# EAGLE design CS-I-POT-10K (EAGLE 6.4)
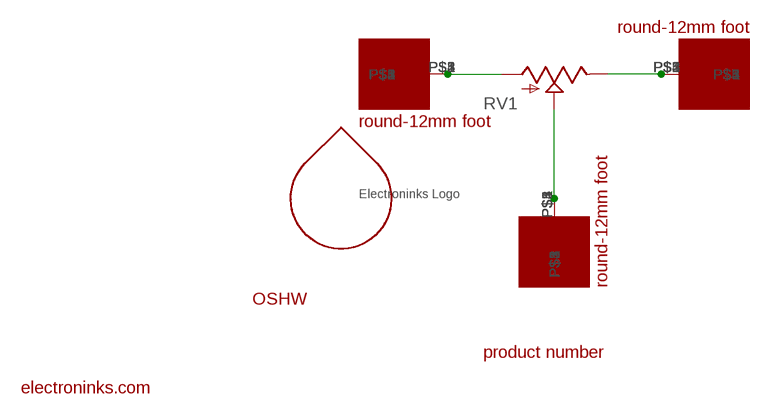
[diagram p0: schematic, sheet 1]

## Parts
RV1  POT  [ALPS_POT]
U$1  ROUND-12MM-FOOT-1.8MM  [ROUND-12MM-FOOT]
U$2  ROUND-12MM-FOOT-1.8MM  [ROUND-12MM-FOOT]
U$3  ROUND-12MM-FOOT-1.8MM  [ROUND-12MM-FOOT]
U$4  ELECTRONINKS_LOGO_15MM  [ELECTRONINKS_LOGO_15MM]
U$5  ELECTRONINKS_COM_15MM  [ELECTRONINKS_COM_15MM]
U$6  DROPLET_LOGO_4MM  [DROPLET_LOGO_4MM]
U$7  OSHW_4MM  [OHSW_4MM]
U$8  CS_I_POT_10K  [CS_I_POT_10K]

## Nets
N$1: RV1.P$3(A) U$1.P$1 U$1.P$2 U$1.P$3 U$1.P$4 U$1.P$5
N$2: RV1.P$1(E) U$3.P$1 U$3.P$2 U$3.P$3 U$3.P$4 U$3.P$5
N$3: RV1.P$2(S) U$2.P$1 U$2.P$2 U$2.P$3 U$2.P$4 U$2.P$5

## Library data of the parts
RV1 = SparkFun-Electromechanical:POT
U$1-U$3 = electroninks:ROUND-12MM-FOOT-1.8MM
U$4 = electroninks:ELECTRONINKS_LOGO_15MM
U$5 = electroninks:ELECTRONINKS_COM_15MM
U$6 = electroninks:DROPLET_LOGO_4MM
U$7 = electroninks:OSHW_4MM
U$8 = electroninks:CS_I_POT_10K

## Board
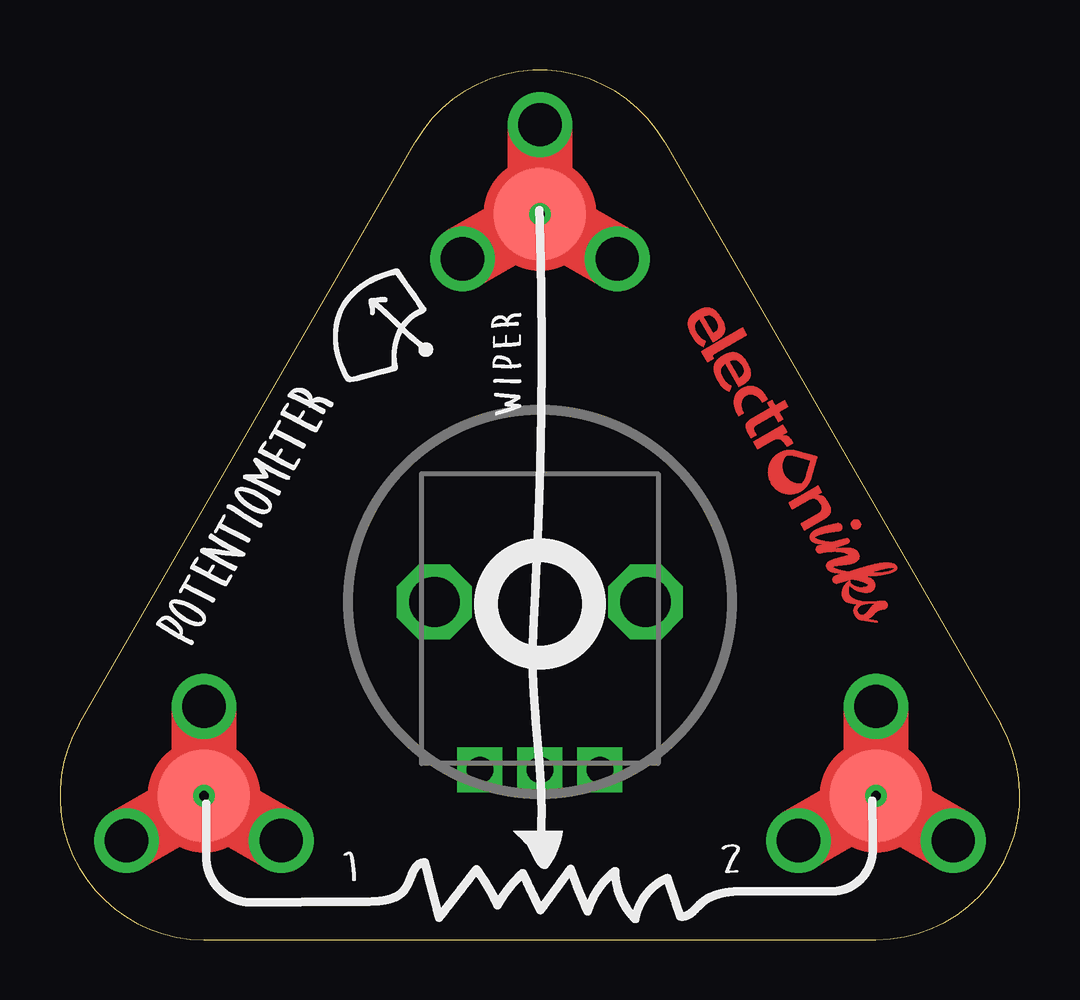
[diagram p1: board, top side]
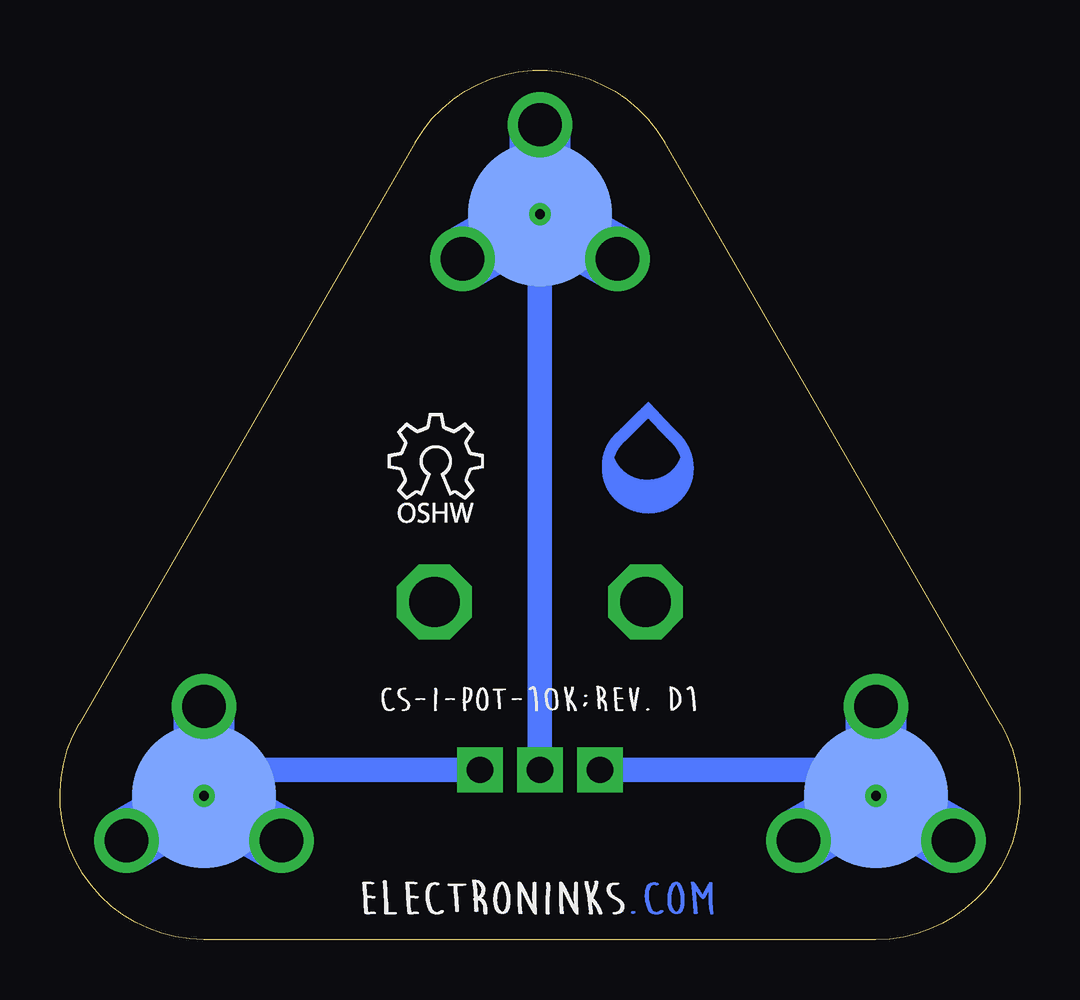
[diagram p2: board, bottom side, seen from below]

Size 39.99 x 36.24 mm. Coordinates in mm from the lower left corner, seen from the top.
Outline: 25.19,33.25 39.19,9 arc-120 33.99,0 5.99,0 arc-120 0.8,9 14.8,33.25 arc-120 25.19,33.25
Copper layers (1*16): Top 0.035mm / dielectric 1.5mm / Bottom 0.035mm
Design rules "default": minimum track width 10mil, minimum drill 24mil, track to track 8mil, track to pad 8mil, pad to pad 8mil, via to via 8mil, smd to smd 8mil, copper to edge 40mil, drill to drill 8mil, minimum pad ring 10mil, minimum via ring 8mil, stop-mask expansion 4mil, vias tented up to drill 0mil, thermal gap 10mil

### Footprints (pad centres in the part's own frame; a part is rotated, then mirrored left to right if it is on the bottom)
ALPS_POT = drill 1.1 pad 1.88 square: P$1 7,-2.5; P$2 7,0; P$3 7,2.5 | drill 2.1 octagon: P$4 0,-4.4; P$5 0,4.4
ROUND-12MM-FOOT = drill 1.8: P$1 -3.726,0; P$2 1.863,3.227; P$3 1.863,-3.227 | smd 3.85 x 3.85: P$4 0,0 | smd 6 x 6 bottom: P$5 0,0 | drill 0.4: P$6 0,0

### Placement (x,y rotation side)
RV1  19.99,14.08 270 top
U$1  33.99,6 270 top
U$2  19.99,30.25 270 top
U$3  5.99,6 270 top
U$4  25.74,25.75 300 top
U$5  27.64,0.67 0 bottom
U$6  15.48,19.27 0 bottom
U$7  26.33,17.1 0 bottom
U$8  26.74,9.25 0 bottom

### Tracks (layer width: path | path; a pad name or v marks a point on that pad's centre or on a via)
N$1
  Top 1: 34.09,8.24 arc-45 34.8,7.95 U$1.P$5
  Top 1.27: 32.91,7.08 arc-90 U$1.P$5
  Bottom 1.016: RV1.P$3 32.91,7.08 arc-90 U$1.P$5
N$2
  Top 1.27: 7.07,7.08 arc90 U$3.P$5
  Bottom 1.016: RV1.P$1 7.07,7.08 arc90 U$3.P$5
N$3
  Bottom 1.016: RV1.P$2 U$2.P$5